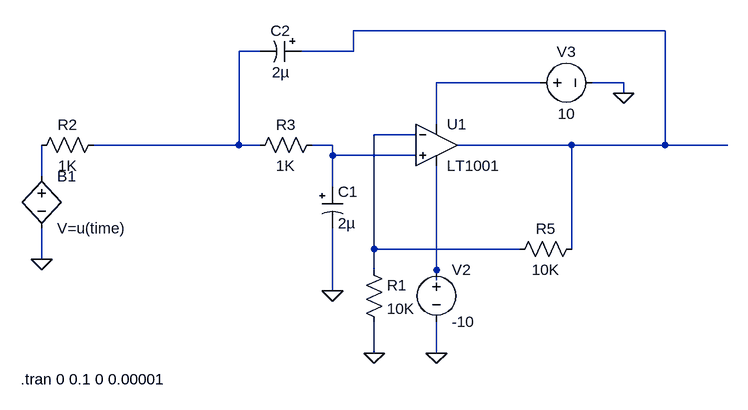
[diagram p0: schematic Design 1.asc]
Design 1.asc, the LTspice schematic file:
Version 4
SHEET 1 1060 680
WIRE 960 -128 480 -128
WIRE 336 -96 304 -96
WIRE 480 -96 480 -128
WIRE 480 -96 400 -96
WIRE 768 -48 608 -48
WIRE 896 -48 848 -48
WIRE 896 -32 896 -48
WIRE 608 16 608 -48
WIRE 576 32 512 32
WIRE 304 48 304 -96
WIRE 304 48 80 48
WIRE 336 48 304 48
WIRE 448 48 416 48
WIRE 816 48 640 48
WIRE 960 48 960 -128
WIRE 960 48 816 48
WIRE 1056 48 960 48
WIRE 448 64 448 48
WIRE 576 64 448 64
WIRE 0 96 0 48
WIRE 448 112 448 64
WIRE 512 208 512 32
WIRE 736 208 512 208
WIRE 816 208 816 48
WIRE 0 224 0 176
WIRE 512 240 512 208
WIRE 608 240 608 80
WIRE 608 256 608 240
WIRE 448 272 448 176
WIRE 512 368 512 320
WIRE 608 368 608 320
FLAG 0 224 0
FLAG 512 368 0
FLAG 448 272 0
FLAG 608 368 0
FLAG 896 -32 0
SYMBOL voltage 608 224 R0
WINDOW 123 0 0 Left 0
WINDOW 39 0 0 Left 0
SYMATTR InstName V2
SYMATTR Value -10
SYMBOL voltage 752 -48 R270
WINDOW 0 32 56 VTop 2
WINDOW 3 -32 56 VBottom 2
WINDOW 123 0 0 Left 0
WINDOW 39 0 0 Left 0
SYMATTR InstName V3
SYMATTR Value 10
SYMBOL res 96 32 R90
WINDOW 0 0 56 VBottom 2
WINDOW 3 32 56 VTop 2
SYMATTR InstName R2
SYMATTR Value 1K
SYMBOL res 432 32 R90
WINDOW 0 0 56 VBottom 2
WINDOW 3 32 56 VTop 2
SYMATTR InstName R3
SYMATTR Value 1K
SYMBOL polcap 432 112 R0
SYMATTR InstName C1
SYMATTR Value 2µ
SYMBOL polcap 400 -112 R90
WINDOW 0 0 32 VBottom 2
WINDOW 3 32 32 VTop 2
SYMATTR InstName C2
SYMATTR Value 2µ
SYMBOL OpAmps\\LT1001 608 -16 R0
SYMATTR InstName U1
SYMBOL res 496 224 R0
SYMATTR InstName R1
SYMATTR Value 10K
SYMBOL res 832 192 R90
WINDOW 0 0 56 VBottom 2
WINDOW 3 32 56 VTop 2
SYMATTR InstName R5
SYMATTR Value 10K
SYMBOL bv 0 80 R0
SYMATTR InstName B1
SYMATTR Value V=u(time)
TEXT -32 408 Left 2 !.tran 0 0.1 0 0.00001

The netlist it stands for:
* Design 1.asc
V2 N007 0 -10
V3 N003 0 10
R2 N002 N006 1K
R3 N005 N002 1K
C1 N005 0 2µ
C2 N001 N002 2µ
XU1 N005 N004 N003 N007 N001 LT1001  ; pins In+ In- V+ V- OUT
R1 N004 0 10K
R5 N001 N004 10K
B1 N006 0 V=u(time)
.tran 0 0.1 0 0.00001
.lib LTC.lib
.backanno
.end